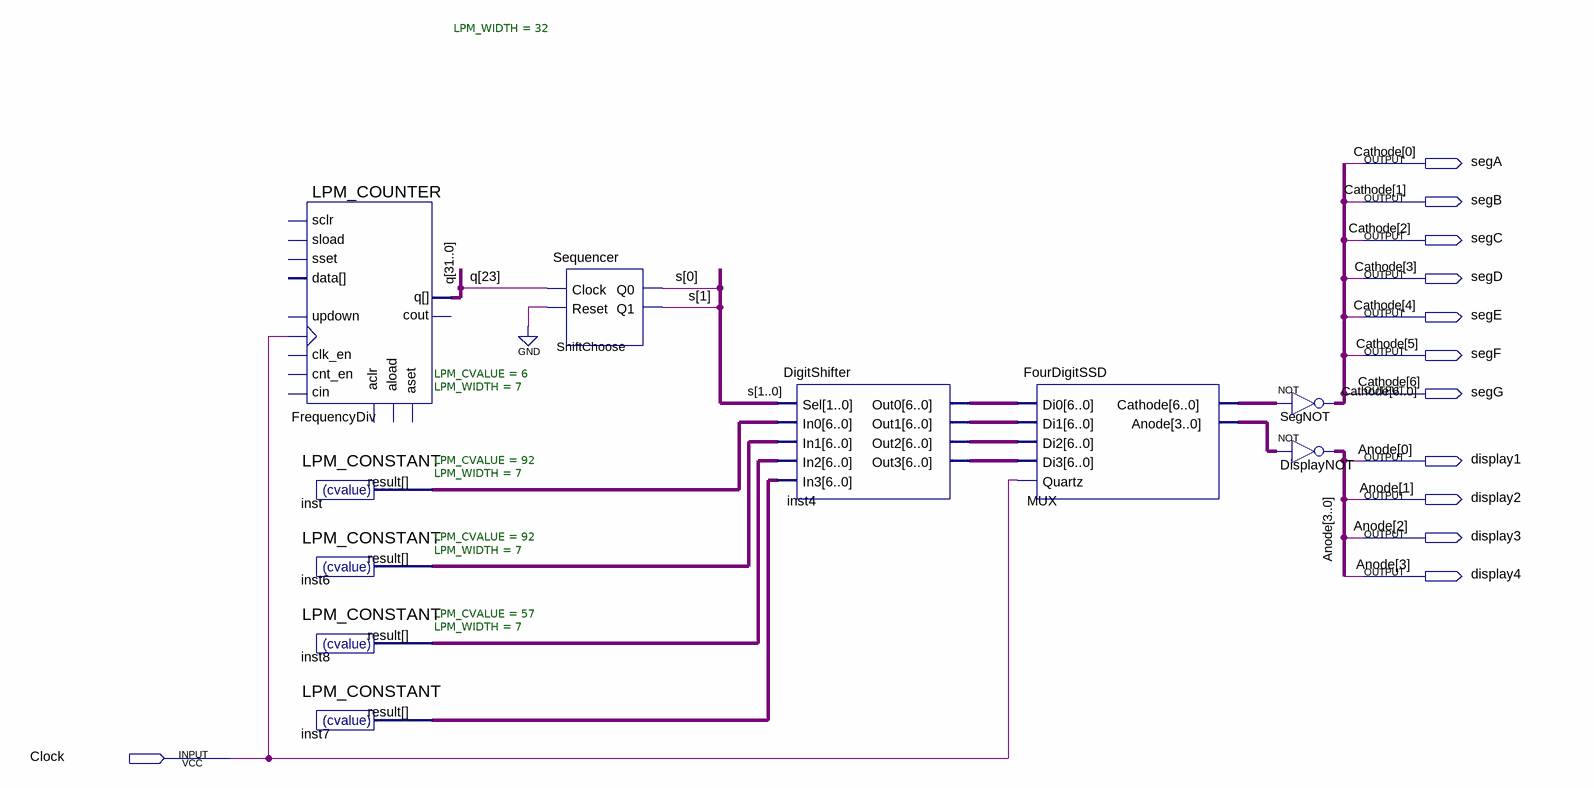
[diagram p0: schematic sheet]
// Quartus schematic FPGALPM.bdf as structural Verilog: 10 symbols, 12 pins
module FPGALPM (
  input  Clock,
  output segA,
  output segB,
  output segC,
  output segD,
  output segE,
  output segF,
  output segG,
  output display1,
  output display2,
  output display3,
  output display4
);

  wire [1:0] s;
  wire [3:0] MUX_anode;
  wire [6:0] inst4_out0, inst4_out1, inst4_out2, inst4_out3, inst6_result, inst7_result, inst8_result,
       inst_result, MUX_cathode;
  wire [31:0] q;

  LPM_COUNTER #(.LPM_WIDTH(32)) FrequencyDiv (
    .clock(Clock), .q(q));  // open: sload, data, clk_en, aload, aclr, aset, cin, sset, updown, cnt_en, sclr, cout
  LPM_CONSTANT #(.LPM_CVALUE(6), .LPM_WIDTH(7)) inst (.result(inst_result));
  LPM_CONSTANT #(.LPM_CVALUE(92), .LPM_WIDTH(7)) inst6 (.result(inst6_result));
  LPM_CONSTANT #(.LPM_CVALUE(92), .LPM_WIDTH(7)) inst8 (.result(inst8_result));
  LPM_CONSTANT #(.LPM_CVALUE(57), .LPM_WIDTH(7)) inst7 (.result(inst7_result));
  Sequencer ShiftChoose (.Clock(q[23]), .Reset(1'b0), .Q0(s[0]), .Q1(s[1]));
  DigitShifter inst4 (
    .Sel(s), .In0(inst_result), .In1(inst6_result), .In2(inst8_result), .In3(inst7_result),
    .Out0(inst4_out0), .Out1(inst4_out1), .Out2(inst4_out2), .Out3(inst4_out3));
  FourDigitSSD MUX (
    .Di0(inst4_out0), .Di1(inst4_out1), .Di2(inst4_out2), .Di3(inst4_out3), .Quartz(Clock),
    .Cathode(MUX_cathode), .Anode(MUX_anode));
  assign {segG, segF, segE, segD, segC, segB, segA} = ~MUX_cathode;  // NOT SegNOT, 7 bits wide
  assign {display4, display3, display2, display1} = ~MUX_anode;  // NOT DisplayNOT, 4 bits wide

  // Other names for the same wires on the sheet: Anode[3:0] = {display4, display3, display2, display1};
  //   Cathode[6:0] = {segG, segF, segE, segD, segC, segB, segA}
endmodule
